# Altium schematic sheet IO.SchDoc
size 228 x 279 mm; SheetNumber: 4; SheetTotal: 4
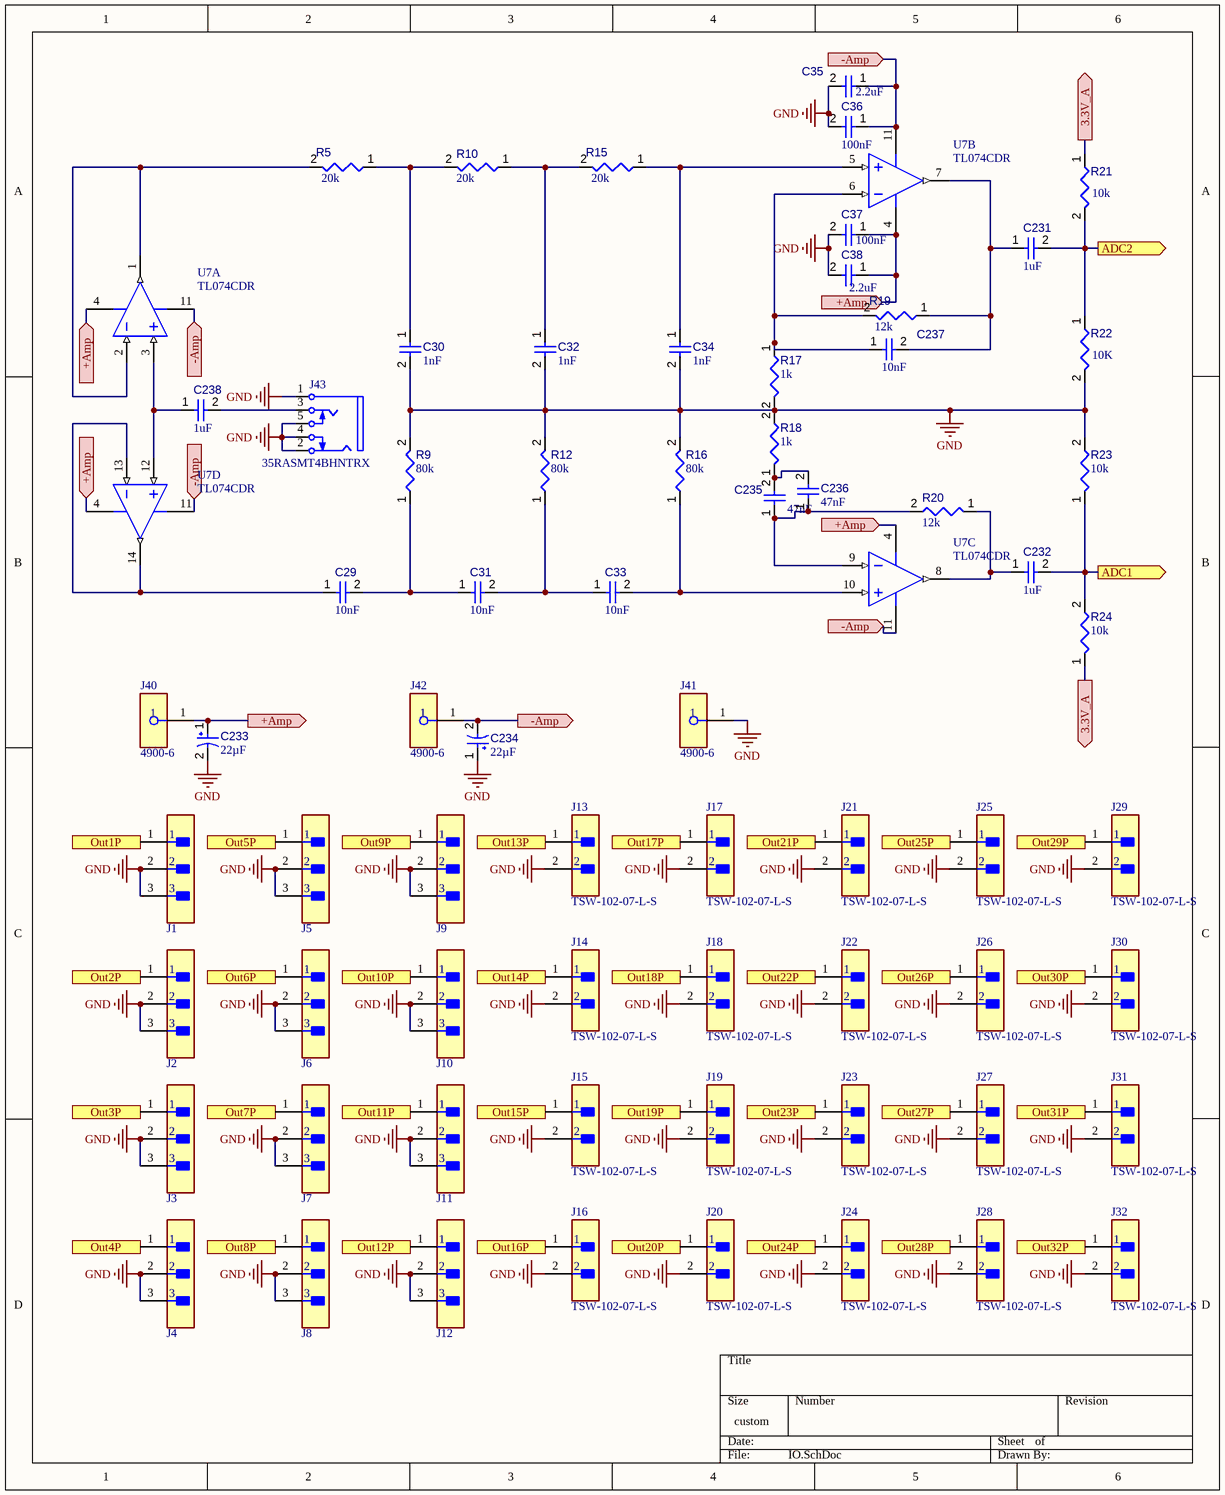
[diagram p0: IO.SchDoc]

## Parts
C29  value 10nF  [CAPC0603(1608)100_L]  (hidden comment: Capacitor 8nF 0603, 12V)
C30  value 1nF  [CAPC0603(1608)100_L]  (hidden comment: Capacitor 1nF 0603, 12V)
C31  value 10nF  [CAPC0603(1608)100_L]  (hidden comment: Capacitor 8nF 0603, 12V)
C32  value 1nF  [CAPC0603(1608)100_L]  (hidden comment: Capacitor 1nF 0603, 12V)
C33  value 10nF  [CAPC0603(1608)100_L]  (hidden comment: Capacitor 10nF 0603, 12V)
C34  value 1nF  [CAPC0603(1608)100_L]  (hidden comment: Capacitor 1nF 0603, 12V)
C35  value 2.2uF  [CAPC0603(1608)100_L]  (hidden comment: Capacitor 2.2uF 0603)
C36  value 100nF  [CAPC0603(1608)100_L]  (hidden comment: Capacitor 100nF 0603)
C37  value 100nF  [CAPC0603(1608)100_L]  (hidden comment: Capacitor 100nF 0603)
C38  value 2.2uF  [CAPC0603(1608)100_L]  (hidden comment: Capacitor 2.2uF 0603)
C231  value 1uF  [CAPC0603(1608)100_L]  (hidden comment: Capacitor 1uF 0603, 12V)
C232  value 1uF  [CAPC0603(1608)100_L]  (hidden comment: Capacitor 1uF 0603, 12V)
C233  value 22µF  [CAPPR55-250-1120X630X1220]  (hidden comment: ECA-2AM220)
C234  value 22µF  [CAPPR55-250-1120X630X1220]  (hidden comment: ECA-2AM220)
C235  value 47nF  [CAPC0603(1608)100_L]  (hidden comment: Capacitor 47nF 0603)
C236  value 47nF  [CAPC0603(1608)100_L]  (hidden comment: Capacitor 47nF 0603)
C237  value 10nF  [CAPC0603(1608)100_L]  (hidden comment: Capacitor 10nF 0603, 12V)
C238  value 1uF  [CAPC0603(1608)100_L]  (hidden comment: Capacitor 1uF 0603, 12V)
J1  87224-3  [FP-87224-3-MFG]  (value not drawn)
J2  87224-3  [FP-87224-3-MFG]  (value not drawn)
J3  87224-3  [FP-87224-3-MFG]  (value not drawn)
J4  87224-3  [FP-87224-3-MFG]  (value not drawn)
J5  87224-3  [FP-87224-3-MFG]  (value not drawn)
J6  87224-3  [FP-87224-3-MFG]  (value not drawn)
J7  87224-3  [FP-87224-3-MFG]  (value not drawn)
J8  87224-3  [FP-87224-3-MFG]  (value not drawn)
J9  87224-3  [FP-87224-3-MFG]  (value not drawn)
J10  87224-3  [FP-87224-3-MFG]  (value not drawn)
J11  87224-3  [FP-87224-3-MFG]  (value not drawn)
J12  87224-3  [FP-87224-3-MFG]  (value not drawn)
J13  TSW-102-07-L-S  [FP-TSW-102-07-L-S-MFG]
J14  TSW-102-07-L-S  [FP-TSW-102-07-L-S-MFG]
J15  TSW-102-07-L-S  [FP-TSW-102-07-L-S-MFG]
J16  TSW-102-07-L-S  [FP-TSW-102-07-L-S-MFG]
J17  TSW-102-07-L-S  [FP-TSW-102-07-L-S-MFG]
J18  TSW-102-07-L-S  [FP-TSW-102-07-L-S-MFG]
J19  TSW-102-07-L-S  [FP-TSW-102-07-L-S-MFG]
J20  TSW-102-07-L-S  [FP-TSW-102-07-L-S-MFG]
J21  TSW-102-07-L-S  [FP-TSW-102-07-L-S-MFG]
J22  TSW-102-07-L-S  [FP-TSW-102-07-L-S-MFG]
J23  TSW-102-07-L-S  [FP-TSW-102-07-L-S-MFG]
J24  TSW-102-07-L-S  [FP-TSW-102-07-L-S-MFG]
J25  TSW-102-07-L-S  [FP-TSW-102-07-L-S-MFG]
J26  TSW-102-07-L-S  [FP-TSW-102-07-L-S-MFG]
J27  TSW-102-07-L-S  [FP-TSW-102-07-L-S-MFG]
J28  TSW-102-07-L-S  [FP-TSW-102-07-L-S-MFG]
J29  TSW-102-07-L-S  [FP-TSW-102-07-L-S-MFG]
J30  TSW-102-07-L-S  [FP-TSW-102-07-L-S-MFG]
J31  TSW-102-07-L-S  [FP-TSW-102-07-L-S-MFG]
J32  TSW-102-07-L-S  [FP-TSW-102-07-L-S-MFG]
J40  4900-6  [FP-4900-6-MFG]
J41  4900-6  [FP-4900-6-MFG]
J42  4900-6  [FP-4900-6-MFG]
J43  35RASMT4BHNTRX  [SWIT-35RASMT4BHNTRX_V]
R5  value 20k  [RESC0603(1608)_L]  (hidden comment: Resistor 20k 0603, 12V)
R9  value 80k  [RESC0603(1608)_L]  (hidden comment: Resistor 80k 0603, 12V)
R10  value 20k  [RESC0603(1608)_L]  (hidden comment: Resistor 20k 0603, 12V)
R12  value 80k  [RESC0603(1608)_L]  (hidden comment: Resistor 80k 0603, 12V)
R15  value 20k  [RESC0603(1608)_L]  (hidden comment: Resistor 20k 0603, 12V)
R16  value 80k  [RESC0603(1608)_L]  (hidden comment: Resistor 80k 0603, 12V)
R17  value 1k  [RESC0603(1608)_L]  (hidden comment: Resistor 1k 0603, 12V)
R18  value 1k  [RESC0603(1608)_L]  (hidden comment: Resistor 1k 0603, 12V)
R19  value 12k  [RESC0603(1608)_L]  (hidden comment: Resistor 12k 0603, 12V)
R20  value 12k  [RESC0603(1608)_L]  (hidden comment: Resistor 12k 0603, 12V)
R21  value 10k  [RESC0603(1608)_L]  (hidden comment: Resistor 10k 0603, 12V)
R22  value 10K  [RESC0603(1608)_L]  (hidden comment: Resistor 10k 0603, 12V)
R23  value 10k  [RESC0603(1608)_L]  (hidden comment: Resistor 10k 0603, 12V)
R24  value 10k  [RESC0603(1608)_L]  (hidden comment: Resistor 10k 0603, 12V)
U7  TL074CDR  [D0014A_N]  (parts A,B,C,D of 4)

## Ports
3.3V_A (out, see DAC[1B], DAC[2B], DAC[2C], DAC[2D], DAC[3B], DAC[3C], DAC[3D], IO[6A]), 3.3V_A (out, see DAC[1B], DAC[2B], DAC[2C], DAC[2D], DAC[3B], DAC[3C], DAC[3D], IO[6C]), +Amp (in, see Amps[1A], Amps[1B], Amps[1C], Amps[1D], Amps[2A], Amps[2B], Amps[2C], Amps[2D], Amps[3A], Amps[3B], Amps[3C], Amps[3D], Amps[4A], Amps[4B], Amps[4C], Amps[4D], Amps[5A], Amps[5B], Amps[5C], Amps[5D], Amps[6A], Amps[6B], Amps[6C], Amps[6D], IO[1B], IO[2B], IO[5A], IO[5B], NUCLEO[2C]), +Amp (in, see Amps[1A], Amps[1B], Amps[1C], Amps[1D], Amps[2A], Amps[2B], Amps[2C], Amps[2D], Amps[3A], Amps[3B], Amps[3C], Amps[3D], Amps[4A], Amps[4B], Amps[4C], Amps[4D], Amps[5A], Amps[5B], Amps[5C], Amps[5D], Amps[6A], Amps[6B], Amps[6C], Amps[6D], IO[1B], IO[2B], IO[5A], NUCLEO[2C]), +Amp (in, see Amps[1A], Amps[1B], Amps[1C], Amps[1D], Amps[2A], Amps[2B], Amps[2C], Amps[2D], Amps[3A], Amps[3B], Amps[3C], Amps[3D], Amps[4A], Amps[4B], Amps[4C], Amps[4D], Amps[5A], Amps[5B], Amps[5C], Amps[5D], Amps[6A], Amps[6B], Amps[6C], Amps[6D], IO[1B], IO[2B], IO[5B], NUCLEO[2C]), +Amp (out, see Amps[1A], Amps[1B], Amps[1C], Amps[1D], Amps[2A], Amps[2B], Amps[2C], Amps[2D], Amps[3A], Amps[3B], Amps[3C], Amps[3D], Amps[4A], Amps[4B], Amps[4C], Amps[4D], Amps[5A], Amps[5B], Amps[5C], Amps[5D], Amps[6A], Amps[6B], Amps[6C], Amps[6D], IO[1B], IO[5A], IO[5B], NUCLEO[2C]), -Amp (in, see Amps[1A], Amps[1B], Amps[1C], Amps[1D], Amps[2A], Amps[2B], Amps[2C], Amps[2D], Amps[3A], Amps[3B], Amps[3C], Amps[3D], Amps[4A], Amps[4B], Amps[4C], Amps[4D], Amps[5A], Amps[5B], Amps[5C], Amps[5D], Amps[6A], Amps[6B], Amps[6C], Amps[6D], IO[1B], IO[3B], IO[5A]), -Amp (in, see Amps[1A], Amps[1B], Amps[1C], Amps[1D], Amps[2A], Amps[2B], Amps[2C], Amps[2D], Amps[3A], Amps[3B], Amps[3C], Amps[3D], Amps[4A], Amps[4B], Amps[4C], Amps[4D], Amps[5A], Amps[5B], Amps[5C], Amps[5D], Amps[6A], Amps[6B], Amps[6C], Amps[6D], IO[1B], IO[3B], IO[5A], IO[5B]), -Amp (in, see Amps[1A], Amps[1B], Amps[1C], Amps[1D], Amps[2A], Amps[2B], Amps[2C], Amps[2D], Amps[3A], Amps[3B], Amps[3C], Amps[3D], Amps[4A], Amps[4B], Amps[4C], Amps[4D], Amps[5A], Amps[5B], Amps[5C], Amps[5D], Amps[6A], Amps[6B], Amps[6C], Amps[6D], IO[1B], IO[3B], IO[5B]), -Amp (out, see Amps[1A], Amps[1B], Amps[1C], Amps[1D], Amps[2A], Amps[2B], Amps[2C], Amps[2D], Amps[3A], Amps[3B], Amps[3C], Amps[3D], Amps[4A], Amps[4B], Amps[4C], Amps[4D], Amps[5A], Amps[5B], Amps[5C], Amps[5D], Amps[6A], Amps[6B], Amps[6C], Amps[6D], IO[1B], IO[5A], IO[5B]), ADC1 (out, see NUCLEO[4A]), ADC2 (out, see NUCLEO[3C]), Out1P (in, see Amps[1A]), Out2P (in, see Amps[1B]), Out3P (in, see Amps[1C]), Out4P (in, see Amps[1D]), Out5P (in, see Amps[2A]), Out6P (in, see Amps[2B]), Out7P (in, see Amps[2C]), Out8P (in, see Amps[2D]), Out9P (in, see Amps[3A]), Out10P (in, see Amps[3B]), Out11P (in, see Amps[3C]), Out12P (in, see Amps[3D]), Out13P (in, see Amps[3A]), Out14P (in, see Amps[3B]), Out15P (in, see Amps[3C]), Out16P (in, see Amps[3D]), Out17P (in, see Amps[4A]), Out18P (in, see Amps[4B]), Out19P (in, see Amps[4C]), Out20P (in, see Amps[4D]), Out21P (in, see Amps[5A]), Out22P (in, see Amps[5B]), Out23P (in, see Amps[5C]), Out24P (in, see Amps[5D]), Out25P (in, see Amps[6A]), Out26P (in, see Amps[6B]), Out27P (in, see Amps[6C]), Out28P (in, see Amps[6D]), Out29P (in, see Amps[6A]), Out30P (in, see Amps[6B]), Out31P (in, see Amps[6C]), Out32P (in, see Amps[6D])

## Nets
GND: C30.2 C32.2 C34.2 C35.2 C36.2 C37.2 C38.2 C233.2 C234.1 J1.2 J1.3 J2.2 J2.3 J3.2 J3.3 J4.2 J4.3 J5.2 J5.3 J6.2 J6.3 J7.2 J7.3 J8.2 J8.3 J9.2 J9.3 J10.2 J10.3 J11.2 J11.3 J12.2 J12.3 J13.2 J14.2 J15.2 J16.2 J17.2 J18.2 J19.2 J20.2 J21.2 J22.2 J23.2 J24.2 J25.2 J26.2 J27.2 J28.2 J29.2 J30.2 J31.2 J32.2 J41.1 J43.1 J43.2 J43.4 J43.5 R9.2 R12.2 R16.2 R17.2 R18.2 R22.2 R23.2
3.3V_A: R21.1 R24.1 ; port 3.3V_A
+Amp: C37.1 C38.1 C233.1 J40.1 U7.4(VCC+) ; port +Amp
-Amp: C35.1 C36.1 C234.2 J42.1 U7.11(VCC-) ; port -Amp
ADC1: C232.2 R23.1 R24.2 ; port ADC1
ADC2: C231.2 R21.2 R22.1 ; port ADC2
Out1P: J1.1 ; port Out1P
Out2P: J2.1 ; port Out2P
Out3P: J3.1 ; port Out3P
Out4P: J4.1 ; port Out4P
Out5P: J5.1 ; port Out5P
Out6P: J6.1 ; port Out6P
Out7P: J7.1 ; port Out7P
Out8P: J8.1 ; port Out8P
Out9P: J9.1 ; port Out9P
Out10P: J10.1 ; port Out10P
Out11P: J11.1 ; port Out11P
Out12P: J12.1 ; port Out12P
Out13P: J13.1 ; port Out13P
Out14P: J14.1 ; port Out14P
Out15P: J15.1 ; port Out15P
Out16P: J16.1 ; port Out16P
Out17P: J17.1 ; port Out17P
Out18P: J18.1 ; port Out18P
Out19P: J19.1 ; port Out19P
Out20P: J20.1 ; port Out20P
Out21P: J21.1 ; port Out21P
Out22P: J22.1 ; port Out22P
Out23P: J23.1 ; port Out23P
Out24P: J24.1 ; port Out24P
Out25P: J25.1 ; port Out25P
Out26P: J26.1 ; port Out26P
Out27P: J27.1 ; port Out27P
Out28P: J28.1 ; port Out28P
Out29P: J29.1 ; port Out29P
Out30P: J30.1 ; port Out30P
Out31P: J31.1 ; port Out31P
Out32P: J32.1 ; port Out32P
NetC29_1: C29.1 U7.13(IN4-) U7.14(OUT4)
NetC29_2: C29.2 C31.1 R9.1
NetC30_1: C30.1 R5.1 R10.2
NetC31_2: C31.2 C33.1 R12.1
NetC32_1: C32.1 R10.1 R15.2
NetC33_2: C33.2 R16.1 U7.10(IN3+)
NetC34_1: C34.1 R15.1 U7.5(IN2+)
NetC231_1: C231.1 C237.2 R19.1 U7.7(OUT2)
NetC232_1: C232.1 R20.1 U7.8(OUT3)
NetC235_1: C235.1 C236.1 R20.2 U7.9(IN3-)
NetC235_2: C235.2 C236.2 R18.1
NetC237_1: C237.1 R17.1 R19.2 U7.6(IN2-)
NetC238_1: C238.1 U7.3(IN1+) U7.12(IN4+)
NetC238_2: C238.2 J43.3
NetR5_2: R5.2 U7.1(OUT1) U7.2(IN1-)

## Library data of the parts
C29 C31 C33 C237 = CMP-001-00075-4: 8nF Cap 0603; Voltage Rating: 10V; Tolerance: 10%; Max Operating Temperature: 85°C; Min Operating Temperature: -55°C; Case/Package: 0603; Mounting Technology: SMT; Pins: 2
C30 C32 C34 = CMP-001-00075-4: 1nF 0603; Voltage Rating: 10V; Tolerance: 10%; Max Operating Temperature: 85°C; Min Operating Temperature: -55°C; Case/Package: 0603; Mounting Technology: SMT; Pins: 2
C35-C38 C235 C236 = CMP-001-00078-4: Tolerance: 10%; Voltage Rating: 50V; Case/Package: 0603; Pins: 2; Max Operating Temperature: 85°C; Mounting Technology: SMT; Min Operating Temperature: -55°C
C231 C232 C238 = CMP-001-00075-4: 1uF 0603; Voltage Rating: 10V; Tolerance: 10%; Max Operating Temperature: 85°C; Min Operating Temperature: -55°C; Case/Package: 0603; Mounting Technology: SMT; Pins: 2
C233 C234 = CMP-001-00035-7: Aluminum Electrolytic Capacitor, 22 uF, +/- 20%, 100 V, -40 to 85 degC, 2-Pin THD, RoHS, Bulk; Manufacturer: Panasonic; Voltage Rating: 100V; Ripple Current: 115mA; Manufacturer URL: http://www.panasonic.com/; Packaging: Bulk; Package Description: 2-Pin Radial Lead, Dia 6.3 mm, Height 12.2 mm; Datasheet URL: https://industrial.panasonic.com/cdbs/www-data/pdf/RDF0000/ABA0000C1047.pdf; RoHS Compliant: True; Package Quantity: 200; Case/Package: Radial; Package Reference: CAPPR55-250-1120X630X1220; Datasheet Version: Mar-16; Pins: 2; Tolerance: 20%; Diameter: 6.3mm; Max Operating Temperature: 85°C; Ripple Current (AC): 115mA; Capacitor Type: Electrolytic; Mounting Technology: TH; Min Operating Temperature: -40°C; Lead Pitch: 2.5mm
J1-J12 = CMP-2000-05697-2: CONN HEADER VERT 3POS 2.54MM; Number of Positions: 3; Gasket: No (Without); High Speed Serial Data Connector: No; Current Rating: 3A; Contact Post Length: 0.125inch; PCB Thickness: 1.397mm; PCB Mount Retention: Without; Connector Type: Plug; Approvals: CSA; PCB Mounting Orientation: Vertical; Pitch: 2.54mm; Mating Alignment: No (Without); Housing Color: Black; Contact Gender: Male; Length: 7.21mm; Max Operating Temperature: 105°C; Strain Relief: No (Without); Contact Material: Bronze; Row Spacing: 2.54mm; Series: AMPMODU MOD II; Board Standoff: No (Without); Package Quantity: 520; Radiation Hardening: No; Contact Protection: No (Without); Stabilizers: No (Without); Number of Rows: 1; Contact Mating Length: 8.08mm; Contact Shape: Square; Depth: 2.54mm; Contact Current Rating: 3A; Flammability Rating: UL94 V-0; Packaging: Carton; Number of Contacts: 3; Orientation: Straight; Mount: Through Hole; Keyed: No; Contact Type: Male Pin; Housing Material: Thermoplastic; High Temperature Housing: No; ELV: Compliant; Contact Plating: Gold; Termination: Through Hole; Selectively Loaded: No (Without); Lead Free: Lead Free; Min Operating Temperature: -65°C; Mating Connector Lock: No (Without); Color: Black; RoHS Compliant: Yes
J13-J32 = CMP-02766-001428-1: CONN HEADER VERT 2POS 2.54MM; Voltage Rating: 550V; Current Rating: 7.6A; Gender: Male; Number of Contacts: 2; Connector Type: Male Pin; Radiation Hardening: No; Orientation: Straight; Contact Plating: Gold; Max Operating Temperature: 125°C; Mount: Through Hole; Package Quantity: 1; Number of Rows: 1; Housing Material: Polyester; RoHS Compliant: Yes; Length: 5.08mm; Max Voltage Rating (AC): 550V; Pitch: 2.54mm; Packaging: Bulk; Depth: 2.54mm; Termination: Solder; Min Operating Temperature: -55°C; Housing Color: Black; Lead Free: Lead Free; Color: Black; Number of Positions: 2; Width: 2.54mm; Max Current Rating: 7.6A; REACH SVHC: No SVHC; Contact Material: Bronze; Contact Mating Length: 0.23inch; Series: TSW; Contact Type: Male Pin
J40-J42 = CMP-73906-000017-1: CONN BANANA JACK TURRET BLUE; Voltage Rating (DC): 60V; Voltage Rating: 2.5kV; Insulation: Mating End Insulated; Current Rating: 15A; Gender: Female; Body Material: Polyphenylene; Insulation Material: Polycarbonate; Contact Material: Brass; Contact Plating: Nickel; Lead Free: Lead Free; Mount: Panel; Color: Blue; Series: -; Termination: Turret; Package Quantity: 1; REACH SVHC: No SVHC; Packaging: Bag; RoHS Compliant: Yes; Number of Pins: 1
J43 = CMP-002-00007-2: Female 3.5 mm Phone Jack, 5 Position, Height 5 mm, RoHS, Tape and Reel; Manufacturer: Switchcraft; Shielding: Unshielded; Connector Type: Audio; Max Current Rating: 3A; Voltage Rating: 250V; Datasheet Version: Rev. C, 07/2014; Case/Package: 35RASMT4BHNTRX; Gender: Female; Package Description: Female 3.5 mm Phone Jack, 5 Position, Height 5 mm; Max Operating Temperature: 85°C; Colour: Black; Manufacturer URL: http://www.switchcraft.com/; Package Reference: 35RASMT4BHNTRX; Packaging: TapeandReel; Pins: 3; Mounting Technology: SM; Min Operating Temperature: -25°C; Contact Material: Copper; Datasheet URL: http://www.switchcraft.com/Drawings/35rasmt4bhntrx_cd.pdf; Contact Plating: Silver; Current Rating: 3A; RoHS Compliant: True; Package Quantity: 800
R5 R10 R15 = CMP-009-00175-3: 20k 0603; Pins: 2; Min Operating Temperature: -55°C; Max Operating Temperature: 155°C; Case/Package: 0603
R9 R12 R16 = CMP-009-00175-3: 80k 0603; Pins: 2; Min Operating Temperature: -55°C; Max Operating Temperature: 155°C; Case/Package: 0603
R17 R18 = CMP-009-00175-3: 1k 0603; Pins: 2; Min Operating Temperature: -55°C; Max Operating Temperature: 155°C; Case/Package: 0603
R19 R20 = CMP-009-00175-3: 12k 0603; Pins: 2; Min Operating Temperature: -55°C; Max Operating Temperature: 155°C; Case/Package: 0603
R21-R24 = CMP-009-00175-3: 10k 0603; Pins: 2; Min Operating Temperature: -55°C; Max Operating Temperature: 155°C; Case/Package: 0603
U7 = CMP-0017-00003-2: Quad Low-Noise JFET-Input General-Purpose Operational Amplifier, 7 to 36 V, 0 to 70 degC, 14-pin SOIC (D14), Green (RoHS & no Sb/Br); Manufacturer: Texas Instruments; Slew Rate(Typ)(V/us): 13; IIB(Max)(pA): 200; Number of Channels: 4; CMRR(Min)(dB): 70; Vn at 1kHz(Typ)(nV/rtHz): 18; Vio (25C)(Max)(mV): 10; Sub Family: General Purpose Amplifier, High Supply Voltage Amplifier (>=30V); Total Supply Voltage(Max)(+5V is 5, +/-5V is 10): 36; Total Supply Voltage(Min)(+5V is 5, +/-5V is 10): 7; GBW(Typ)(MHz): 3; Rating: Military; Iq per channel(Max)(mA): 2.5; Eco-Plan: Green (RoHS & no Sb/Br); ComponentLink3Description: Package Specification; ComponentLink1URL: http://www.ti.com/; Mounting Technology: Surface Mount; ComponentLink3URL: http://www.ti.com/lit/ml/mpds177g/mpds177g.pdf; PartNumber: TL074CDR; DatasheetVersion: SLOS080J; ComponentLink2URL: http://www.ti.com/lit/ds/symlink/tl074.pdf; ComponentLink1Description: Manufacturer URL; PackageVersion: 4040047-5/M, 06/2011; PackageReference: D0014A; Code_JEDEC: MS-012; ComponentLink2Description: Datasheet; Offset Drift(Typ)(uV/C): 18; PackageDescription: 14-Pin Plastic Small Outline, Body 8.65 x 3.90 mm, Pitch 1.27 mm